# Altium schematic sheet Sheet4.SchDoc
size A1; SheetNumber: 1; SheetTotal: 1; SPICEModelCacheKEYTHUZU: <root> / <DocumentId>KEYTHUZU</DocumentId> / </root>
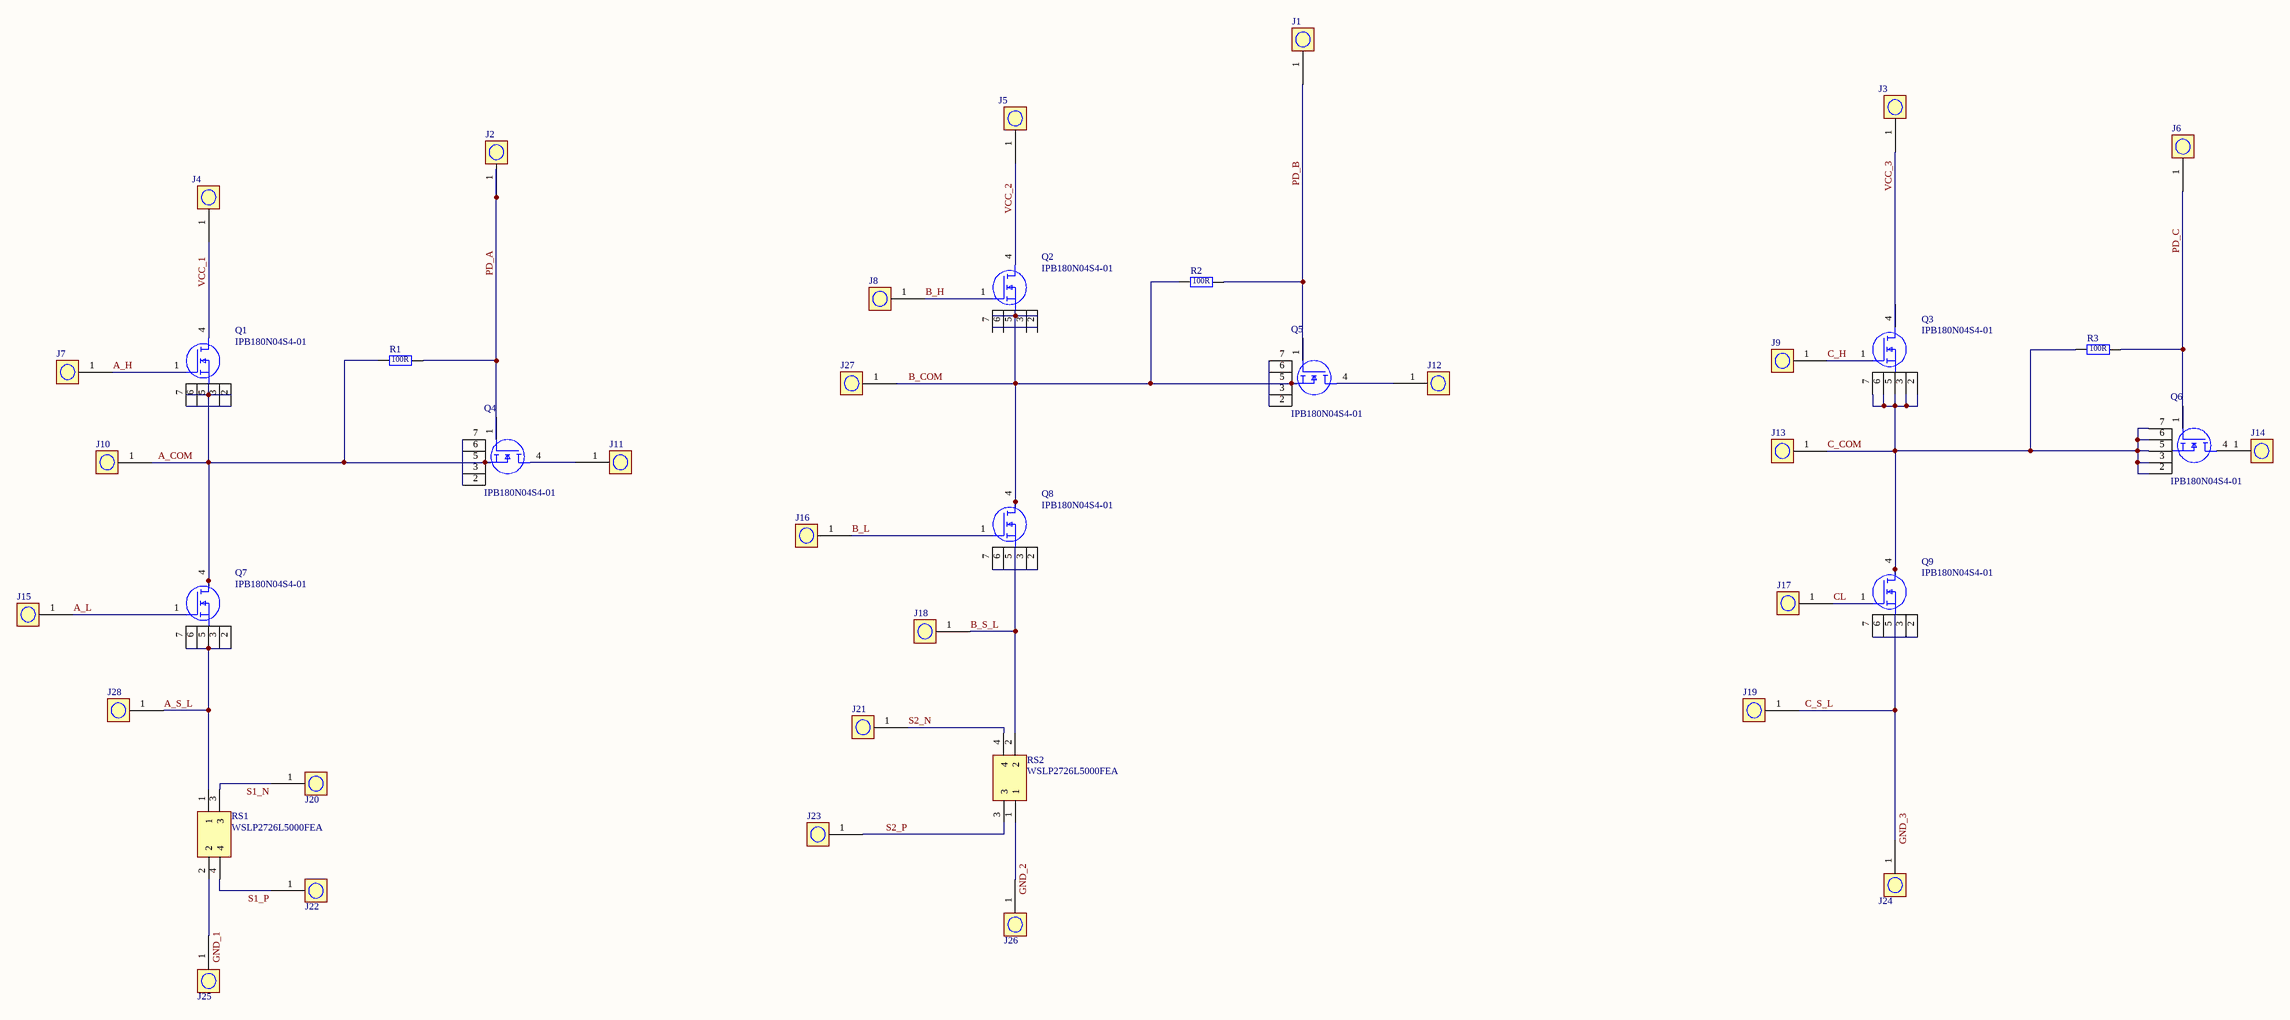
[diagram p0: Sheet4.SchDoc]

## Parts
J1  CON_SMD_SMALL  [CONN_SMALL]  (value not drawn)
J2  CON_SMD_SMALL  [CONN_SMALL]  (value not drawn)
J3  CON_SMD_SMALL  [CONN_SMALL]  (value not drawn)
J4  CON_SMD_SMALL  [CONN_SMALL]  (value not drawn)
J5  CON_SMD_SMALL  [CONN_SMALL]  (value not drawn)
J6  CON_SMD_SMALL  [CONN_SMALL]  (value not drawn)
J7  CON_SMD_SMALL  [CONN_SMALL]  (value not drawn)
J8  CON_SMD_SMALL  [CONN_SMALL]  (value not drawn)
J9  CON_SMD_SMALL  [CONN_SMALL]  (value not drawn)
J10  CON_SMD_SMALL  [CONN_SMALL]  (value not drawn)
J11  CON_SMD_SMALL  [CONN_SMALL]  (value not drawn)
J12  CON_SMD_SMALL  [CONN_SMALL]  (value not drawn)
J13  CON_SMD_SMALL  [CONN_SMALL]  (value not drawn)
J14  CON_SMD_SMALL  [CONN_SMALL]  (value not drawn)
J15  CON_SMD_SMALL  [CONN_SMALL]  (value not drawn)
J16  CON_SMD_SMALL  [CONN_SMALL]  (value not drawn)
J17  CON_SMD_SMALL  [CONN_SMALL]  (value not drawn)
J18  CON_SMD_SMALL  [CONN_SMALL]  (value not drawn)
J19  CON_SMD_SMALL  [CONN_SMALL]  (value not drawn)
J20  CON_SMD_SMALL  [CONN_SMALL]  (value not drawn)
J21  CON_SMD_SMALL  [CONN_SMALL]  (value not drawn)
J22  CON_SMD_SMALL  [CONN_SMALL]  (value not drawn)
J23  CON_SMD_SMALL  [CONN_SMALL]  (value not drawn)
J24  CON_SMD_SMALL  [CON_BIG]  (value not drawn)
J25  CON_SMD_SMALL  [CONN_SMALL]  (value not drawn)
J26  CON_SMD_SMALL  [CONN_SMALL]  (value not drawn)
J27  CON_SMD_SMALL  [CONN_SMALL]  (value not drawn)
J28  CON_SMD_SMALL  [CONN_SMALL]  (value not drawn)
Q1  IPB180N04S4-01  [IPB240N04S4R9ATMA1]
Q2  IPB180N04S4-01  [IPB240N04S4R9ATMA1]
Q3  IPB180N04S4-01  [IPB240N04S4R9ATMA1]
Q4  IPB180N04S4-01  [IPB240N04S4R9ATMA1]
Q5  IPB180N04S4-01  [IPB240N04S4R9ATMA1]
Q6  IPB180N04S4-01  [IPB240N04S4R9ATMA1]
Q7  IPB180N04S4-01  [IPB240N04S4R9ATMA1]
Q8  IPB180N04S4-01  [IPB240N04S4R9ATMA1]
Q9  IPB180N04S4-01  [IPB240N04S4R9ATMA1]
R1  value 100R  [RESC1608X06N]  (hidden comment: R)
R2  value 100R  [RESC1608X06N]  (hidden comment: R)
R3  value 100R  [RESC1608X06N]  (hidden comment: R)
RS1  WSLP2726L5000FEA  [WSL27261L000FEA]
RS2  WSLP2726L5000FEA  [WSL27261L000FEA]

## Nets
A_COM: J10.1 Q1.5(S_3) Q4.5(S_3) Q7.4(D) R1.1
A_H: J7.1 Q1.1(G)
A_L: J15.1 Q7.1(G)
A_S_L: J28.1 RS1.1
B_COM: J27.1 Q2.5(S_3) Q5.5(S_3) Q8.4(D) R2.1
B_H: J8.1 Q2.1(G)
B_L: J16.1 Q8.1(G)
B_S_L: J18.1 Q8.5(S_3) RS2.2
C_COM: J13.1 Q9.4(D) R3.1
C_H: J9.1 Q3.1(G)
C_S_L: J19.1 J24.1 Q9.5(S_3)  [also labelled GND_3]
CL: J17.1 Q9.1(G)
GND_1: J25.1 RS1.2
GND_2: J26.1 RS2.1
PD_A: J2.1 Q4.1(G) R1.2
PD_B: J1.1 Q5.1(G) R2.2
PD_C: J6.1 Q6.1(G) R3.2
S1_N: J20.1 RS1.3
S1_P: J22.1 RS1.4
S2_N: J21.1 RS2.4
S2_P: J23.1 RS2.3
VCC_1: J4.1 Q1.4(D)
VCC_2: J5.1 Q2.4(D)
VCC_3: J3.1 Q3.4(D)
NetJ11_1: J11.1 Q4.4(D)
NetJ12_1: J12.1 Q5.4(D)
NetJ14_1: J14.1 Q6.4(D)

Not connected (* = marked no-connect by the designer): Q1 2(S_1) 3(S_2) 6(S_4) 7(S_5); Q2 2(S_1) 3(S_2) 6(S_4) 7(S_5); Q3 2(S_1) 3(S_2) 5(S_3) 6(S_4) 7(S_5); Q4 2(S_1) 3(S_2) 6(S_4) 7(S_5); Q5 2(S_1) 3(S_2) 6(S_4) 7(S_5); Q6 2(S_1) 3(S_2) 5(S_3) 6(S_4) 7(S_5); Q7 2(S_1) 3(S_2) 5(S_3) 6(S_4) 7(S_5); Q8 2(S_1) 3(S_2) 6(S_4) 7(S_5); Q9 2(S_1) 3(S_2) 6(S_4) 7(S_5)

## Library data of the parts
Q1-Q9 = IPB180N04S4-01: MOSFET (N-Channel); Manufacturer_Name: Infineon; Datasheet Link: https://www.infineon.com/dgdl/Infineon-IPB180N04S4_01-DS-v01_00-en.pdf?fileId=db3a304328c6bd5c01291c432c5d5d67; Height: 4.5mm; Mouser Part Number: 726-IPB180N04S4-01; Mouser Price/Stock: https://www.mouser.co.uk/ProductDetail/Infineon-Technologies/IPB180N04S4-01?qs=HwMeRNENlMacaRTn%252BkmAXA%3D%3D; Manufacturer_Part_Number: IPB180N04S4-01
RS1 RS2 = WSLP2726L5000FEA: Resistor; Manufacturer_Name: Vishay; Datasheet Link: https://www.vishay.com/docs/30179/wslp2726.pdf; Height: 2mm; Manufacturer_Part_Number: WSLP2726L5000FEA; Mouser Part Number: 71-WSLP2726L5000FEA; Mouser Price/Stock: https://www.mouser.co.uk/ProductDetail/Vishay-Dale/WSLP2726L5000FEA?qs=H%252BW4FWGGyHeDwweg1TYd4Q%3D%3D; Arrow Part Number: WSLP2726L5000FEA; Arrow Price/Stock: https://www.arrow.com/en/products/wslp2726l5000fea/vishay?region=nac
R1-R3 = R: MPN: *; Link: *